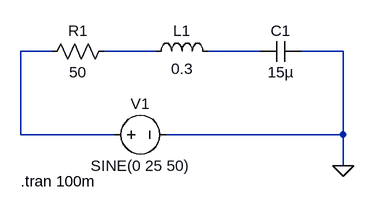
[diagram p0: schematic RLC_AC Transients.asc]
RLC_AC Transients.asc, the LTspice schematic file:
Version 4.1
SHEET 1 880 680
WIRE 48 128 0 128
WIRE 208 128 128 128
WIRE 368 128 288 128
WIRE 496 128 432 128
WIRE 0 256 0 128
WIRE 144 256 0 256
WIRE 496 256 496 128
WIRE 496 256 224 256
WIRE 496 304 496 256
FLAG 496 304 0
SYMBOL res 32 144 R270
WINDOW 0 32 56 VTop 2
WINDOW 3 0 56 VBottom 2
SYMATTR InstName R1
SYMATTR Value 50
SYMBOL ind 192 144 R270
WINDOW 0 32 56 VTop 2
WINDOW 3 5 56 VBottom 2
SYMATTR InstName L1
SYMATTR Value 0.3
SYMBOL cap 368 144 R270
WINDOW 0 32 32 VTop 2
WINDOW 3 0 32 VBottom 2
SYMATTR InstName C1
SYMATTR Value 15µ
SYMBOL voltage 128 256 R270
WINDOW 0 32 56 VTop 2
WINDOW 3 -32 56 VBottom 2
WINDOW 123 0 0 Left 0
WINDOW 39 0 0 Left 0
SYMATTR InstName V1
SYMATTR Value SINE(0 25 50)
TEXT 0 328 Left 2 !.tran 100m

The netlist it stands for:
* RLC_AC Transients.asc
R1 N001 N002 50
L1 N002 N003 0.3
C1 N003 0 15µ
V1 N001 0 SINE(0 25 50)
.tran 100m
.backanno
.end